# Altium schematic sheet EXPANSION_CONNECTORS.SchDoc: Expansion Connectors
size A3; Date: Not used; ApprovedBy: Not used; CheckedBy: Not used; Author: Not used; CompanyName: STMicroelectronics; DrawnBy: Not used; Engineer: Not used; Organization: Not used; Address1: Not used; Address2: Not used; Address3: Not used; Address4: Not used; DocumentNumber: Not used; Revision: Not used; SheetNumber: 13; SheetTotal: 16; CurrentTime: Not used; CurrentDate: Not used; Time: Not used; DocumentFullPathAndName: Not used; DocumentName: Not used; ModifiedDate: Not used; ImagePath: Not used; ProjectName: Not used; Application_BuildNumber: Not used
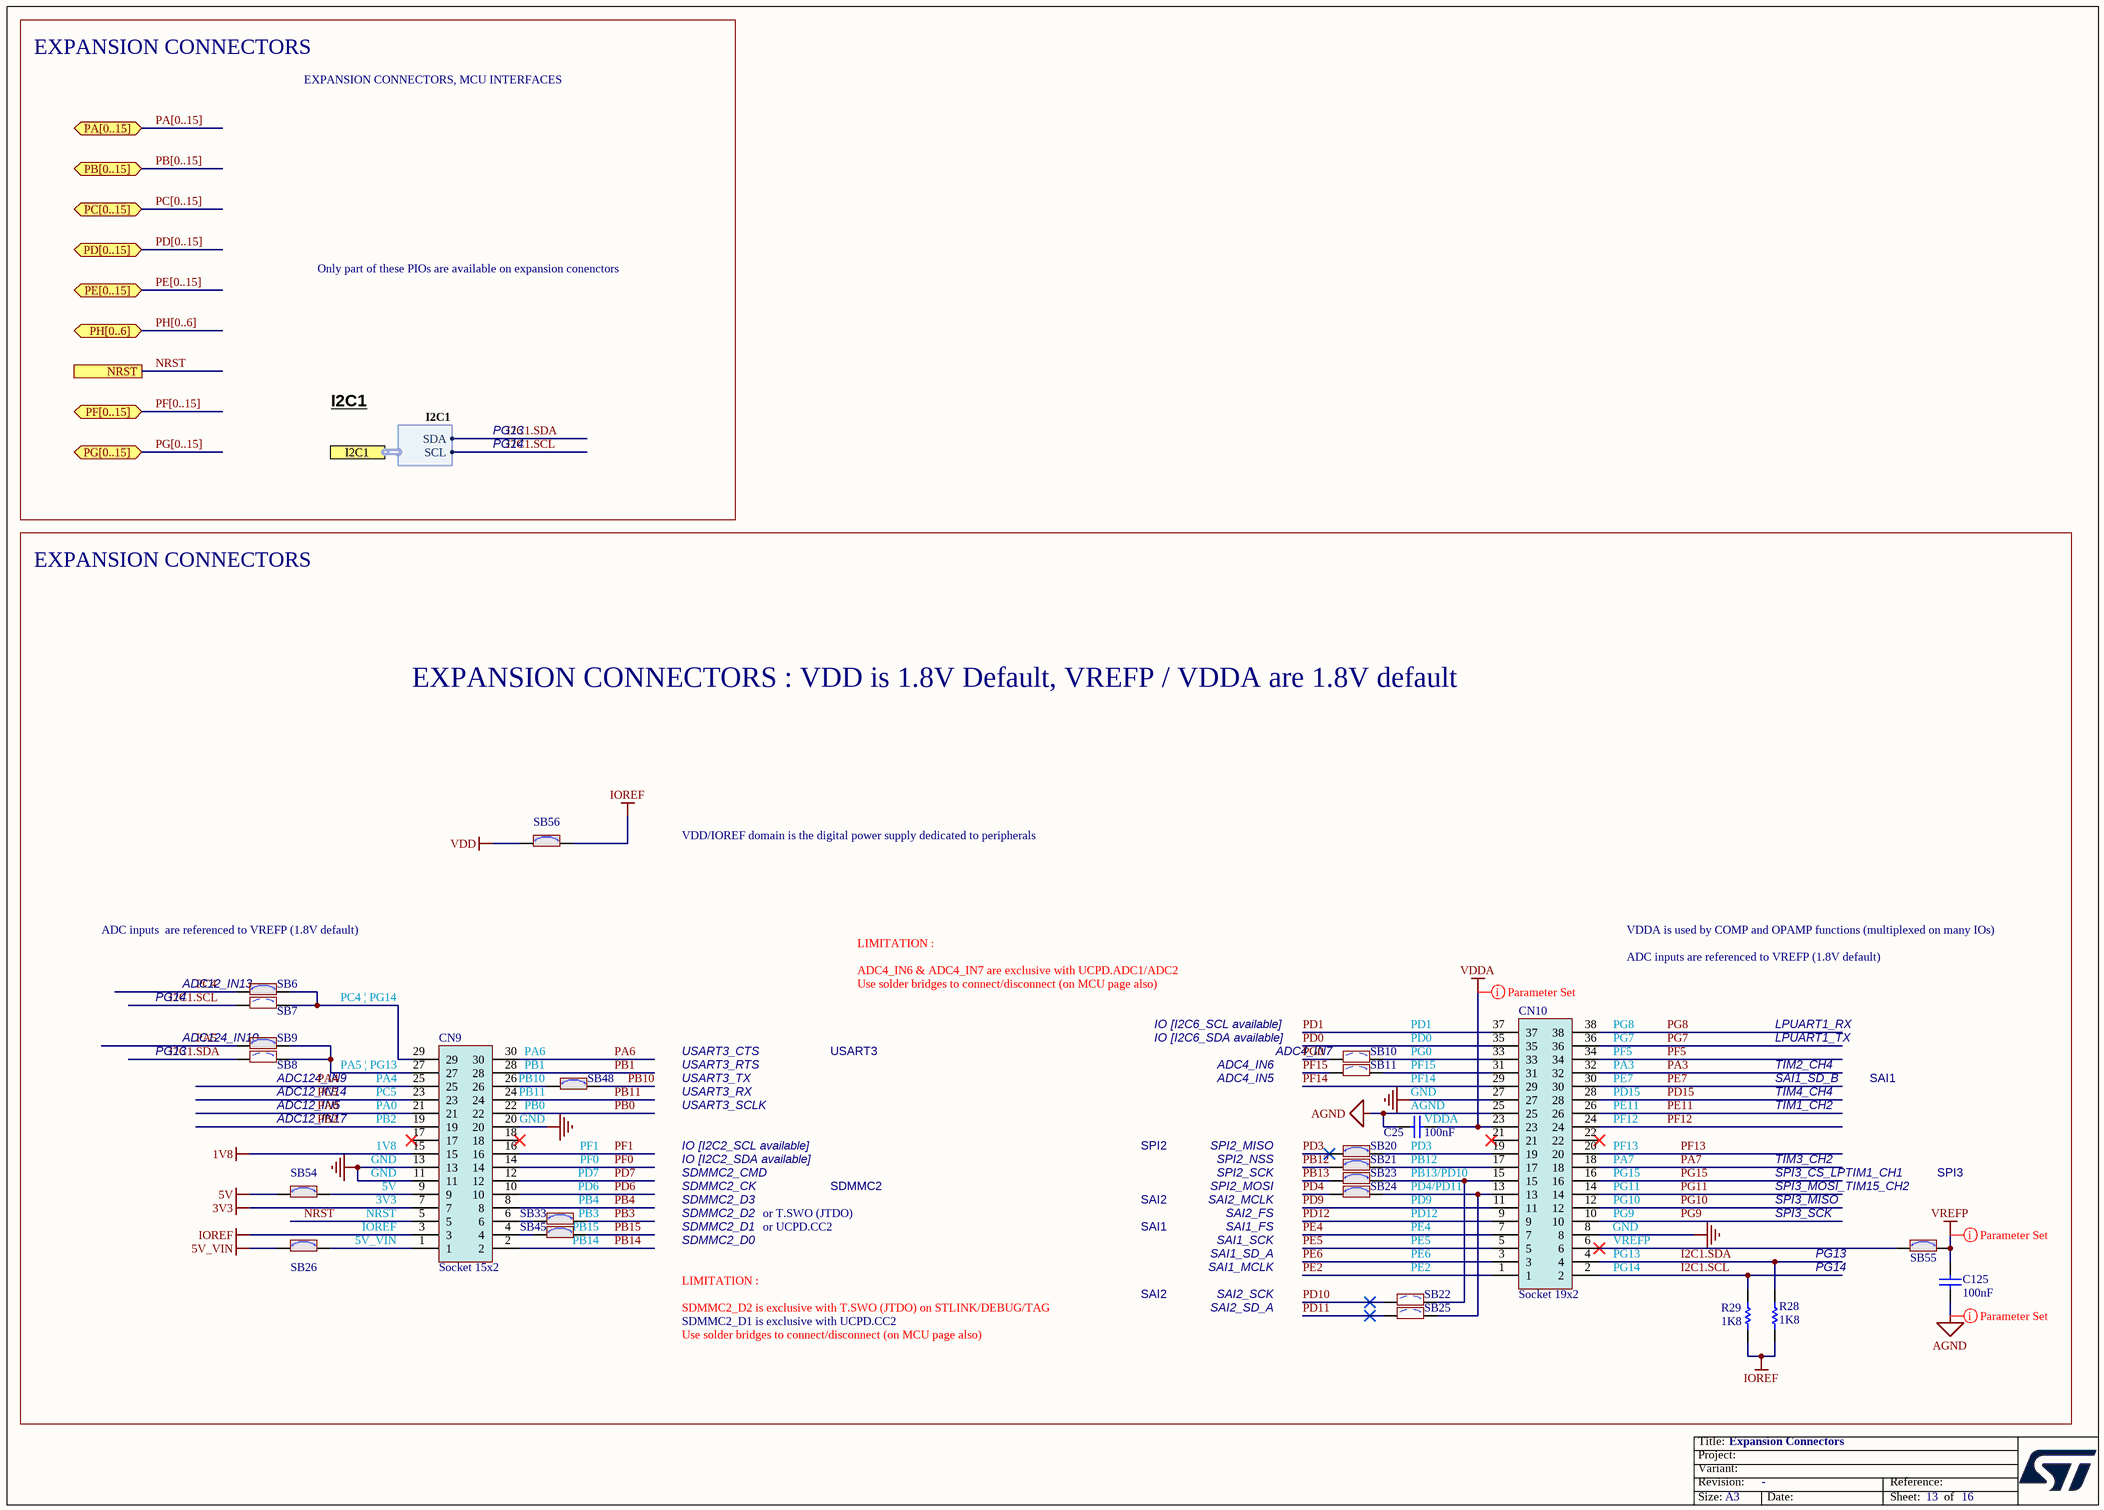
[diagram p0: EXPANSION_CONNECTORS.SchDoc]

## Parts
C25  value 100nF  [C0603]  (hidden comment: Capacitor)
C125  value 100nF  [C0603]  (hidden comment: Capacitor)
CN9  Socket 15x2  [CON_SAMTEC_SSW-115-21-F-D]
CN10  Socket 19x2  [CON_SAMTEC_SSW-119-21-F-D]
R28  value 1K8  [R0402]  (hidden comment: Resistor)
R29  value 1K8  [R0402]  (hidden comment: Resistor)
SB6  SB_ON  [SOLDER-BRIDGE_R0402-0R]  (value not drawn)
SB7  SB_OFF  [SOLDER-BRIDGE_R0402-0R]  (value not drawn)
SB8  SB_OFF  [SOLDER-BRIDGE_R0402-0R]  (value not drawn)
SB9  SB_ON  [SOLDER-BRIDGE_R0402-0R]  (value not drawn)
SB10  SB_OFF  [SOLDER-BRIDGE_R0402-0R]  (value not drawn)
SB11  SB_OFF  [SOLDER-BRIDGE_R0402-0R]  (value not drawn)
SB20  SB_ON  [SOLDER-BRIDGE_R0402-0R]  (value not drawn)
SB21  SB_ON  [SOLDER-BRIDGE_R0402-0R]  (value not drawn)
SB22  SB_OFF  [SOLDER-BRIDGE_R0402-0R]  (value not drawn)
SB23  SB_ON  [SOLDER-BRIDGE_R0402-0R]  (value not drawn)
SB24  SB_ON  [SOLDER-BRIDGE_R0402-0R]  (value not drawn)
SB25  SB_OFF  [SOLDER-BRIDGE_R0402-0R]  (value not drawn)
SB26  SB_ON  [SOLDER-BRIDGE_R0402-0R]  (value not drawn)
SB33  SB_ON  [SOLDER-BRIDGE_R0402-0R]  (value not drawn)
SB45  SB_ON  [SOLDER-BRIDGE_R0402-0R]  (value not drawn)
SB48  SB_ON  [SOLDER-BRIDGE_R0402-0R]  (value not drawn)
SB54  SB_ON  [SOLDER-BRIDGE_R0402-0R]  (value not drawn)
SB55  SB_ON  [SOLDER-BRIDGE_R0402-0R]  (value not drawn)
SB56  SB_ON  [SOLDER-BRIDGE_R0402-0R]  (value not drawn)

## Ports
I2C1 (harness I2C1), NRST, PA[0..15] (bidir), PB[0..15] (bidir), PC[0..15] (bidir), PD[0..15] (bidir), PE[0..15] (bidir), PF[0..15] (bidir), PG[0..15] (bidir), PH[0..6] (bidir)

## Harnesses
I2C1: SDA, SCL

## Nets
1V8: CN9.15
3V3: CN9.7
5V: SB54.1
5V_VIN: SB26.1
AGND: C25.1 C125.1 CN10.25
GND: CN9.11 CN9.13 CN9.20 CN10.8 CN10.27
IOREF: CN9.3 R28.2 R29.2 SB56.2
VDD: SB56.1
VDDA: C25.2 CN10.23
VREFP: C125.2 SB55.2
I2C1.SCL: CN10.2 R29.1 SB7.1 ; port I2C1.SCL
I2C1.SDA: CN10.4 R28.1 SB8.1 ; port I2C1.SDA
NRST: CN9.5 ; port NRST
PA0: CN9.21
PA3: CN10.32
PA4: CN9.25
PA5: SB9.1
PA6: CN9.30
PA7: CN10.18
PB0: CN9.22
PB1: CN9.28
PB2: CN9.19
PB3: SB33.2
PB4: CN9.8
PB10: SB48.2
PB11: CN9.24
PB12: SB21.1
PB13: SB23.1
PB14: CN9.2
PB15: SB45.2
PC4: SB6.1
PC5: CN9.23
PD0: CN10.35
PD1: CN10.37
PD3: SB20.1
PD4: SB24.1
PD6: CN9.10
PD7: CN9.12
PD9: CN10.11
PD10: SB22.1
PD11: SB25.1
PD12: CN10.9
PD15: CN10.28
PE2: CN10.1
PE4: CN10.7
PE5: CN10.5
PE6: CN10.3
PE7: CN10.30
PE11: CN10.26
PF0: CN9.14
PF1: CN9.16
PF5: CN10.34
PF12: CN10.24
PF13: CN10.20
PF14: CN10.29
PF15: SB11.1
PG0: SB10.1
PG7: CN10.36
PG8: CN10.38
PG9: CN10.10
PG10: CN10.12
PG11: CN10.14
PG15: CN10.16
NetCN9_1: CN9.1 SB26.2
NetCN9_4: CN9.4 SB45.1
NetCN9_6: CN9.6 SB33.1
NetCN9_9: CN9.9 SB54.2
NetCN9_26: CN9.26 SB48.1
NetCN9_27: CN9.27 SB8.2 SB9.2
NetCN9_29: CN9.29 SB6.2 SB7.2
NetCN10_6: CN10.6 SB55.1
NetCN10_13: CN10.13 SB24.2 SB25.2
NetCN10_15: CN10.15 SB22.2 SB23.2
NetCN10_17: CN10.17 SB21.2
NetCN10_19: CN10.19 SB20.2
NetCN10_31: CN10.31 SB11.2
NetCN10_33: CN10.33 SB10.2

Not connected (* = marked no-connect by the designer): CN9 17* 18*; CN10 21* 22*

## Buses and harness runs
bus PA[0..15] = port PA[0..15]
bus PB[0..15] = port PB[0..15]
bus PC[0..15] = port PC[0..15]
bus PD[0..15] = port PD[0..15]
bus PE[0..15] = port PE[0..15]
bus PF[0..15] = port PF[0..15]
bus PG[0..15] = port PG[0..15]
bus PH[0..6] = port PH[0..6]

## Layout directives
net class VREFP_AGND_VDD: AGND, VDDA, VREFP

## Notes on the sheet
- EXPANSION CONNECTORS
- EXPANSION CONNECTORS, MCU INTERFACES
- Only part of these PIOs are available on expansion conenctors
- I2C1
- PG13
- PG14
- EXPANSION CONNECTORS : VDD is 1.8V Default, VREFP / VDDA are 1.8V default
- VDD/IOREF domain is the digital power supply dedicated to peripherals
- ADC inputs  are referenced to VREFP (1.8V default)
- ADC12_IN13
- ADC4_IN6 & ADC4_IN7 are exclusive with UCPD.ADC1/ADC2
- Use solder bridges to connect/disconnect (on MCU page also)
- LIMITATION :
- ADC inputs are referenced to VREFP (1.8V default)
- VDDA is used by COMP and OPAMP functions (multiplexed on many IOs)
- ADC124_IN10
- PC4 | PG14
- PA6
- USART3_CTS
- USART3
- IO [I2C6_SDA available]
- IO [I2C6_SCL available]
- ADC4_IN7
- PG0
- PD0
- PD1
- (near CN10) PF5
- (near CN10) PG7
- (near CN10) PG8
- LPUART1_TX
- LPUART1_RX
- ADC12_IN17
- ADC12_IN5
- ADC12_IN14
- (near SB8) ADC124_IN9
- (near CN9) PB2
- (near CN9) PA0
- (near CN9) PC5
- (near CN9) PA4
- PA5 | PG13
- (near SB48) PB0
- (near SB48) PB11
- (near SB48) PB10
- (near SB48) PB1
- GND
- USART3_TX
- USART3_RX
- USART3_SCLK
- USART3_RTS
- ADC4_IN5
- ADC4_IN6
- PF14
- PF15
- (near C25) AGND
- (near C25) VDDA
- (near CN10) PF12
- (near CN10) PE11
- (near CN10) PD15
- (near CN10) PE7
- (near CN10) PA3
- TIM1_CH2
- TIM4_CH4
- TIM2_CH4
- SAI1_SD_B
- SAI1
- (near CN9) 5V
- (near CN9) GND
- (near CN9) 1V8
- PD6
- PD7
- PF0
- PF1
- SDMMC2_CK
- SDMMC2_CMD
- IO [I2C2_SDA available]
- IO [I2C2_SCL available]
- SDMMC2
- SPI2
- SPI2_MISO
- SPI2_NSS
- SPI2_MOSI
- SPI2_SCK
- PD4/PD11
- PB13/PD10
- PB12
- (near C25) PD3
- (near CN10) PF13
- (near CN10) PA7
- (near CN10) PG15
- (near CN10) PG11
- TIM3_CH2
- SPI3_CS_LPTIM1_CH1
- SPI3_MOSI_TIM15_CH2
- SPI3
- IOREF
- NRST
- 3V3
- 5V_VIN
- (near SB33) PB4
- PB3
- (near SB45) PB14
- PB15
- SDMMC2_D0
- SDMMC2_D1
- SDMMC2_D2
- SDMMC2_D3
- or T.SWO (JTDO)
- or UCPD.CC2
- SAI2
- SAI1_SD_A
- SAI1_SCK
- SAI1_FS
- SAI2_FS
- SAI2_MCLK
- PE6
- PE5
- PE4
- PD12
- PD9
- (near CN10) VREFP
- (near CN10) PG10
- (near CN10) PG9
- (near CN10) PG13
- (near CN10) GND
- SPI3_SCK
- SPI3_MISO
- SDMMC2_D2 is exclusive with T.SWO (JTDO) on STLINK/DEBUG/TAG
- SDMMC2_D1 is exclusive with UCPD.CC2
- SAI1_MCLK
- SAI2_SD_A
- SAI2_SCK
- PE2
- (near CN10) PG14
- Title:
- Project:
- Size:
- Revision:
- Variant:
- A3
- -
- Date:
- Reference:
- Sheet:
- of

## Library data of the parts
C25 C125 = MCD-00211: Capacitor, MLCC, 100nF, 16V, X7R, +/-10%, 0603, T=0.8mm; Manufacturer_Part_Number: CC0603KRX7R7BB104; Manufacturer: YAGEO; Part_Preference: Recommended; Order_Code_RS: 669-8763; Component_Country_Of_Origin: China; Internal_Part_Number: MCD-00211; Status: Released; Part_Type: Capacitor; Package: 0603; ComponentLink1URL: http://tunmcdsvn.tun.st.com/Component_Documentation_Library/Trunk/Capacitor/YAGEO_X7R_Series; Order_Code_Digikey: 311-1088-1-ND; Order_Code_Farnell: 432210
CN9 = MCD-02943: Socket, 15x2, 2.54mm, VR, TH, T=8.51mm/2.64mm; Part_Type: Connector; Part_Preference: Recommended; Manufacturer: SAMTEC; Manufacturer_Part_Number: SSW-115-21-F-D; Partial_Alternate_Internal_Part_Number: MCD-02945; ShowFields: YES; ID: 5059; Internal_Part_Number: MCD-02943; Value: Socket 15x2; Status: New; ComponentLink1URL: http://tunmcdsvn.tun.st.com/Component_Documentation_Library/Trunk/Connector/SAMTEC_SSW-SSQ(TH)_Series/; Order_Code_Digikey: SSW-115-21-F-D-ND; Order_Code_Farnell: N/A; Order_Code_RS: N/A
CN10 = MCD-02944: Socket, 19x2, 2.54mm, VR, TH, T=8.51mm/2.64mm; Part_Type: Connector; Part_Preference: Recommended; Manufacturer: SAMTEC; Manufacturer_Part_Number: SSW-119-21-F-D; Partial_Alternate_Internal_Part_Number: MCD-02946; ShowFields: YES; ID: 5060; Internal_Part_Number: MCD-02944; Value: Socket 19x2; Status: New; ComponentLink1URL: http://tunmcdsvn.tun.st.com/Component_Documentation_Library/Trunk/Connector/SAMTEC_SSW-SSQ(TH)_Series/; Order_Code_Digikey: SSW-119-21-F-D-ND; Order_Code_Farnell: N/A; Order_Code_RS: N/A
R28 R29 = MCD-00409: Resistor, 1K8, 0402, +/-1%, 1/16W; Manufacturer_Part_Number: RC0402FR-071K8L; Manufacturer: YAGEO; Part_Preference: Recommended; Component_Country_Of_Origin: China; Internal_Part_Number: MCD-00409; Status: Released; Part_Type: Resistor; Package: 0402; ComponentLink1URL: http://tunmcdsvn.tun.st.com/Component_Documentation_Library/Trunk/Resistor/YAGEO_RC_L_Series; Order_Code_Digikey: 311-1.80KLRCT-ND; Order_Code_Farnell: 9239260; Order_Code_RS: N/A
SB6 SB9 SB20 SB21 SB23 SB24 SB26 SB33 SB45 SB48 SB54-SB56 = MCD-01618: Solder Bridge 0402 ON; Part_Type: Misc; Manufacturer_Part_Number: RC0402JR-070RL; Manufacturer: YAGEO; Part_Preference: Recommended; Order_Code_RS: 618-5804; Component_Country_Of_Origin: China; Internal_Part_Number: MCD-01618; Status: Released; Package: SB0402; ComponentLink1URL: http://tunmcdsvn.tun.st.com/Component_Datasheet_Library/Trunk/Resistors/Yageo_Resistor_RC0402-series; Order_Code_Digikey: 311-0.0JRTR-ND; Order_Code_Farnell: 2363467
SB7 SB8 = MCD-02162: Solder Bridge 0402 OFF; Part_Type: Misc; Manufacturer_Part_Number: RC0402JR-070RL; Manufacturer: YAGEO; Part_Preference: Recommended; Order_Code_RS: 618-5804; Internal_Part_Number: MCD-02162; Status: Checked; Alternate_Manufacturer_Part_Number: N/A; Alternate_Manufacturer: N/A; Package: SB0402; ComponentLink1URL: http://tunmcdsvn.tun.st.com/Component_Datasheet_Library/Trunk/Resistors/Yageo_Resistor_RC0402-series; Order_Code_Digikey: 311-0.0JRTR-ND; Order_Code_Farnell: 2363467
SB10 SB11 SB22 SB25 = MCD-02162: Solder Bridge 0402 OFF; Part_Type: Misc; Manufacturer_Part_Number: RC0402JR-070RL; Manufacturer: YAGEO; Part_Preference: Recommended; Order_Code_RS: 618-5804; Component_Country_Of_Origin: China; Internal_Part_Number: MCD-02162; Status: Checked; Package: SB0402; ComponentLink1URL: http://tunmcdsvn.tun.st.com/Component_Datasheet_Library/Trunk/Resistors/Yageo_Resistor_RC0402-series; Order_Code_Digikey: 311-0.0JRTR-ND; Order_Code_Farnell: 2363467